# EAGLE design PSU (EAGLE 6.4)
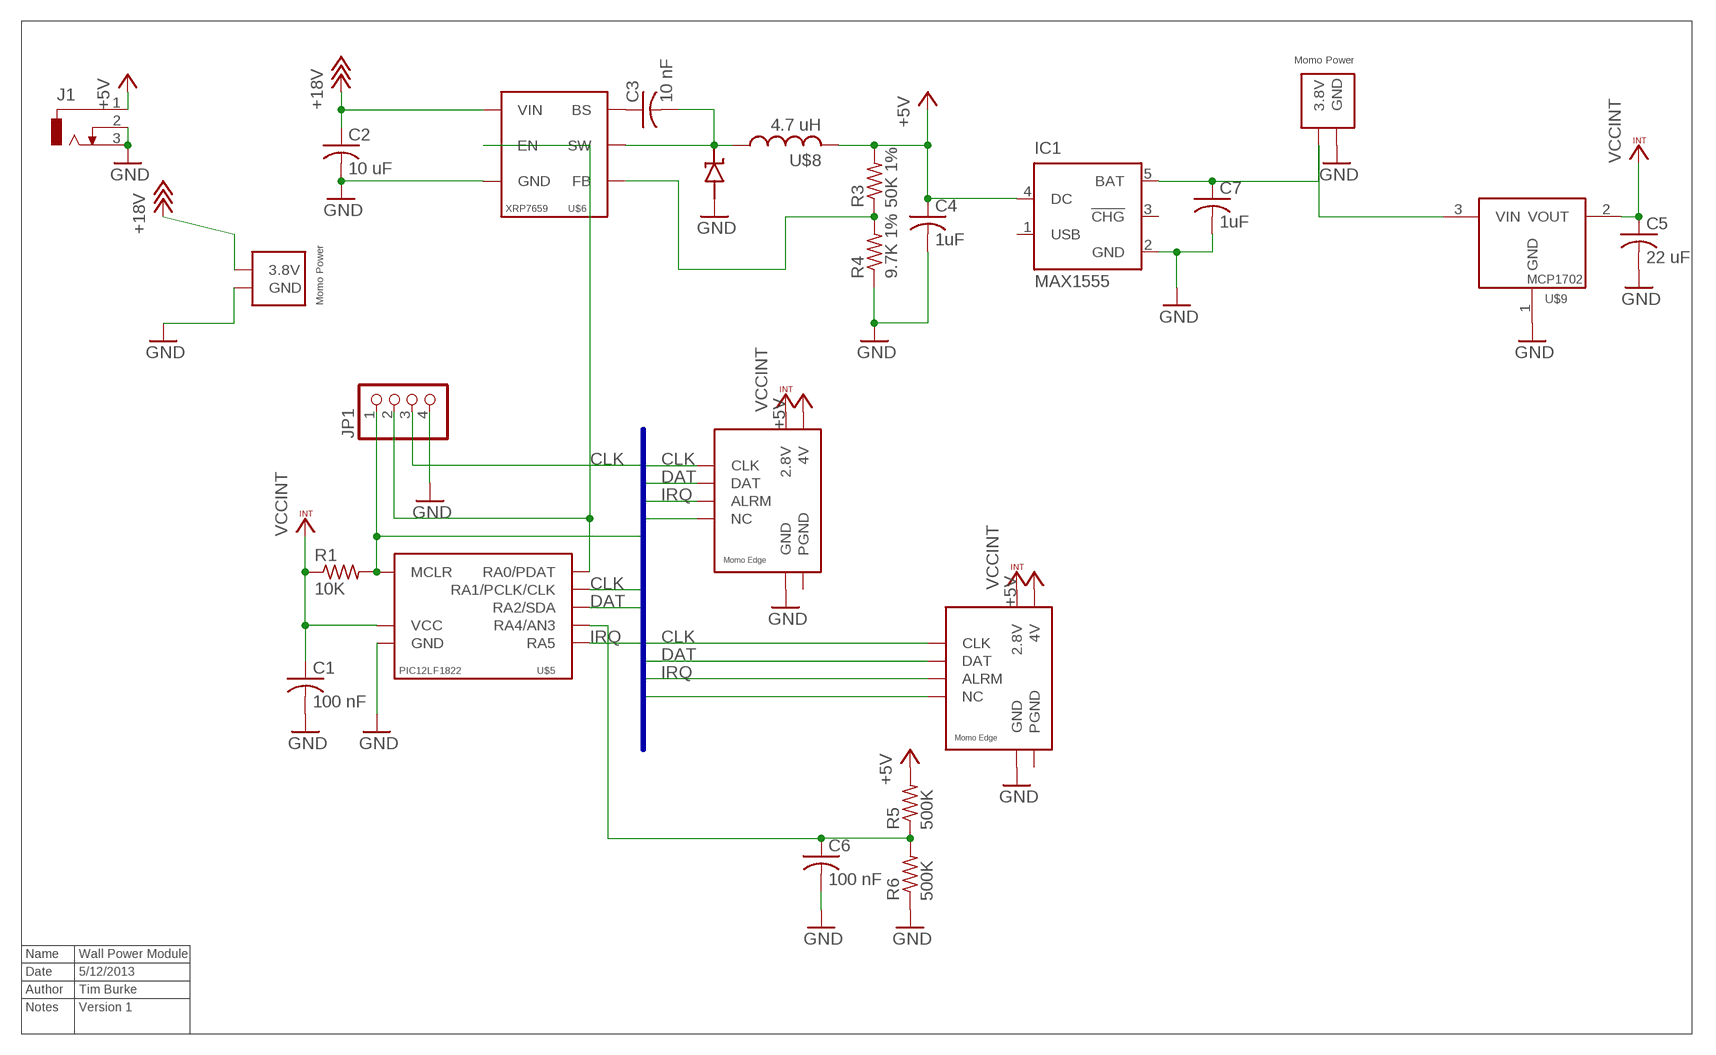
[diagram p0: schematic, sheet 1]

## Parts
C1  100 nF  C-USC0402  [C0402]
C2  10 uF  C-USC0805  [C0805]
C3  10 nF  C-USC0402  [C0402]
C4  1uF  C-USC0402  [C0402]
C5  22 uF  C-USC0402  [C0402]
C6  100 nF  C-USC0402  [C0402]
C7  1uF  C-USC0402  [C0402]
IC1  MAX1555  [SOT23-5L]
J1  DCJ0303  [DCJ0303]
JP1  PINHD-1X4  [1X04]
R1  10K  R-US_R0603  [R0603]
R3  50K 1%  R-US_R0603  [R0603]
R4  9.7K 1%  R-US_R0603  [R0603]
R5  500K  R-US_R0603  [R0603]
R6  500K  R-US_R0603  [R0603]
U$1  MOMO-EDGE-POWER-M  [MOMO-EDGE-SMALL-2M]
U$2  MOMO-EDGE-POWER-M  [MOMO-EDGE-SMALL-2M]
U$5  PIC12LF1822  [SOIC8]
U$6  XRP7659  [SOT23-6L]
U$7  DIODE_SS2P3  [DIODE_SS2P3]
U$8  4.7 uH  NR6028-INDUCTOR  [NR6028-INDUCTOR]
U$9  MCP1702  [SOT23]
U$10  MOMO-EDGE-8F  [MOMO-EDGE-8F]
U$11  MOMO-EDGE-8M  [MOMO-EDGE-8M]

## Nets
+5V: C4.1 IC1.4(DC) J1.1 R3.2 R5.2 U$8.2 U$10.V4.(4V) U$11.V4(4V)
+18V: C2.1 U$1.1(3.8V) U$6.5(VIN)
CLK: JP1.3 U$5.6(RA1/PCLK/CLK) U$10.CLK U$11.CLK
DAT: U$5.5(RA2/SDA) U$10.DAT U$11.DAT
GND: C1.2 C2.2 C4.2 C5.2 C6.2 C7.2 IC1.2(GND) J1.2 J1.3 JP1.4 R4.1 R6.1 U$1.2(GND) U$2.2(GND) U$5.8(GND) U$6.2(GND) U$7.AN U$9.1(GND) U$10.GND U$11.GND
IRQ: U$5.2(RA5) U$10.ARLM(ALRM) U$11.ALRM
MCLR: JP1.1 R1.2 U$5.4(MCLR) U$10.NV(NC) U$11.NC
N$1: C7.1 IC1.5(BAT) U$2.1(3.8V) U$9.3(VIN)
N$2: C3.2 U$6.6(SW) U$7.CATH U$8.1
N$4: C3.1 U$6.1(BS)
N$5: C6.1 R5.1 R6.2 U$5.3(RA4/AN3)
N$6: R3.1 R4.2 U$6.3(FB)
N$8: JP1.2 U$5.7(RA0/PDAT) U$6.4(EN)
VCCINT: C1.1 C5.1 R1.1 U$5.1(VCC) U$9.2(VOUT) U$10.V28(2.8V) U$11.V28(2.8V)
Unconnected: IC1.1(USB) IC1.3(!CHG)

## Buses
PICBUS:CLK,DAT,IRQ,MCLR

## Notes on the sheet
- Name | Wall Power Module
- Date | 5/12/2013
- Author | Tim Burke
- Notes | Version 1

## Power pins joined to a net without a drawn wire
PGND: U$10.PGND U$11.PGND

## Library data of the parts
C1-C7 = rcl:C-US: CAPACITOR, American symbol
IC1 = maxim:MAX1555: Dual-Input USB/AC Adapter 1-Cell Li+ Battery Chargers Source: http://www.maxim-ic.com .. MAX1551-MAX1555.pdf; MF: MAXIM; MPN: MAX1555EZK+T; OC_FARNELL: 1628222; OC_NEWARK: 59J2761
J1 = con-jack:DCJ0303: DC POWER JACK Source: DCJ0303.pdf; OC_FARNELL: unknown; OC_NEWARK: unknown
JP1 = pinhead:PINHD-1X4: PIN HEADER
R1 R3-R6 = rcl:R-US_: RESISTOR, American symbol
U$1 U$2 = components:MOMO-EDGE-POWER-M
U$5 = components:PIC12LF1822
U$6 = components:XRP7659
U$7 = components:DIODE_SS2P3
U$8 = components:NR6028-INDUCTOR
U$9 = components:MCP1702
U$10 = components:MOMO-EDGE-8F
U$11 = components:MOMO-EDGE-8M

## Board
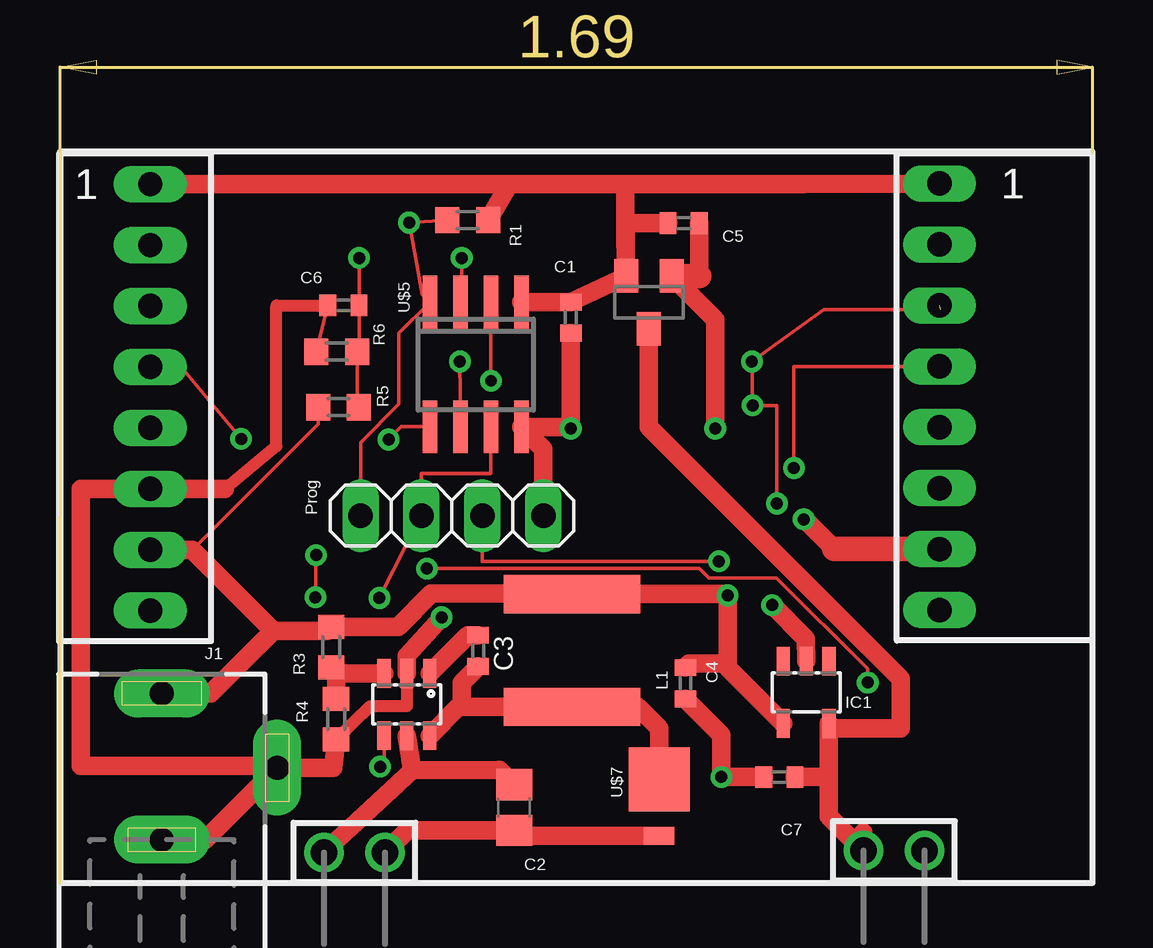
[diagram p1: board, top side]
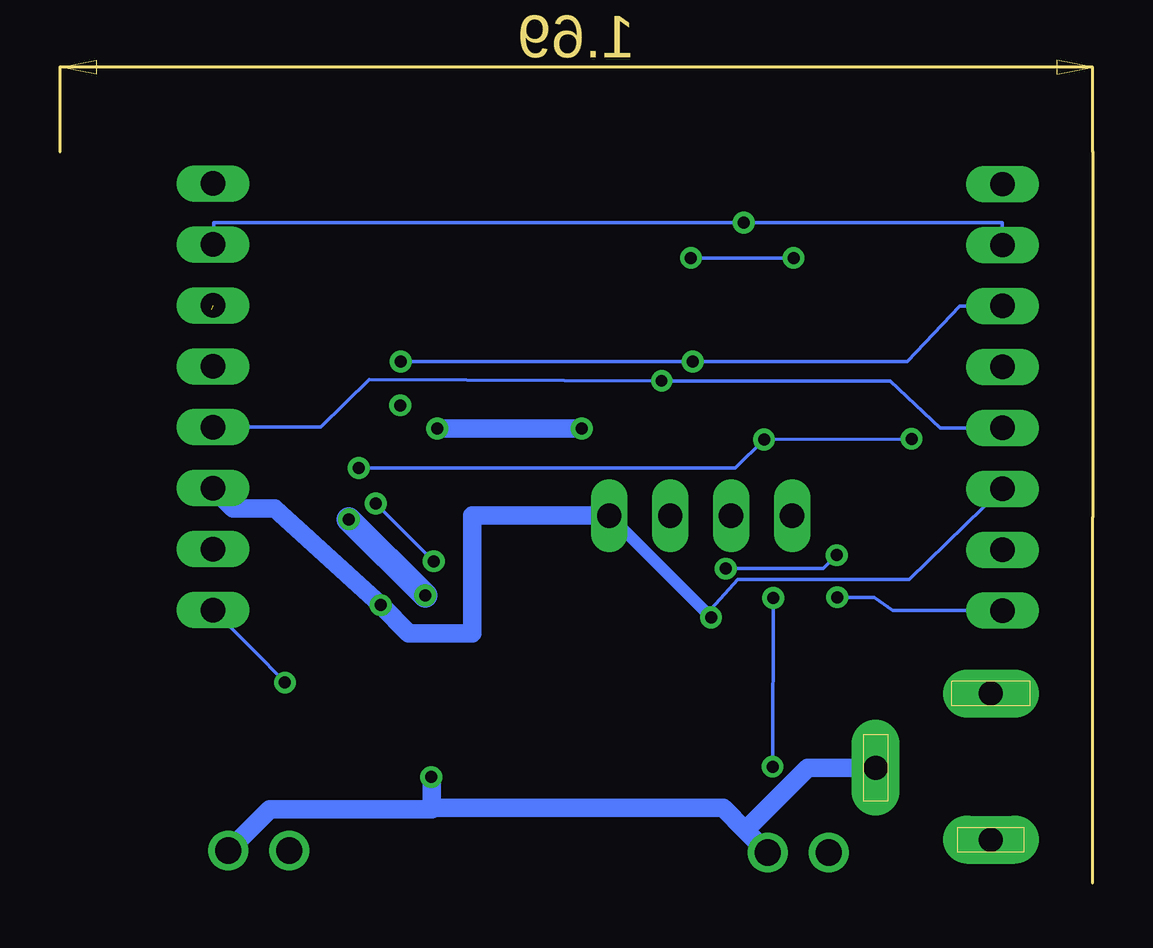
[diagram p2: board, bottom side, seen from below]

Size 43.03 x 34.31 mm. Coordinates in mm from the lower left corner, seen from the top.
Copper layers (1*16): Top 0.035mm / dielectric 1.5mm / Bottom 0.035mm
Design rules "default *": minimum track width 6mil, minimum drill 19mil, track to track 6mil, track to pad 6mil, pad to pad 6mil, via to via 6mil, smd to smd 6mil, copper to edge 40mil, drill to drill 8mil, minimum pad ring 10mil, minimum via ring 8mil, stop-mask expansion 4mil, vias tented up to drill 0mil, thermal gap 10mil

### Footprints (pad centres in the part's own frame; a part is rotated, then mirrored left to right if it is on the bottom)
C0402 = smd 0.7 x 0.9: 1 -0.65,0; 2 0.65,0
C0805 = smd 1.3 x 1.5: 1 -0.95,0; 2 0.95,0
SOT23-5L = smd 0.55 x 1.2: 1 -0.95,-1.3; 2 0,-1.3; 3 0.95,-1.3; 4 0.95,1.3; 5 -0.95,1.3
DCJ0303 = drill 1 pad 2 long: 1 0,3.1; 2 4.8,0; 3 0,-3
1X04 = drill 1.016 long: 1 -3.81,0; 2 -1.27,0; 3 1.27,0; 4 3.81,0
R0603 = smd 1 x 1.1: 1 -0.85,0; 2 0.85,0
MOMO-EDGE-SMALL-2M = drill 1.1: 1 1.27,0; 2 -1.27,0
SOIC8 = smd 0.6 x 2.2: 1 -1.905,-2.6; 2 -0.635,-2.6; 3 0.635,-2.6; 4 1.905,-2.6; 5 1.905,2.6; 6 0.635,2.6; 7 -0.635,2.6; 8 -1.905,2.6
SOT23-6L = smd 0.55 x 1.2: 1 -0.95,-1.3; 2 0,-1.3; 3 0.95,-1.3; 4 0.95,1.3; 5 0,1.3; 6 -0.95,1.3
DIODE_SS2P3 = smd 0.762 x 1.27: AN 2.349,0 | smd 2.667 x 2.54: CATH 0,0
NR6028-INDUCTOR = smd 1.6 x 5.7: 1 0,0; 2 4.7,0
SOT23 = smd 1 x 1.4: 1 -0.95,-1.1; 2 0.95,-1.1; 3 0,1.1
MOMO-EDGE-8F = drill 1.016 long: ARLM 0,0; CLK 0,5.08; DAT 0,2.54; GND 0,-2.54; NV 0,7.62; PGND 0,-7.62; V4. 0,-5.08; V28 0,10.16
MOMO-EDGE-8M = drill 1.016 long: ALRM 0,0; CLK 0,5.08; DAT 0,2.54; GND 0,-2.54; NC 0,7.62; PGND 0,-7.62; V4 0,-5.08; V28 0,10.16

### Placement (x,y rotation side)
C1  21.29,23.57 270 top
C2  18.92,3.15 270 top
C3  17.42,9.68 270 top
C4  26.06,8.33 270 top
C5  25.98,27.51 0 top
C6  11.81,24.08 180 top
C7  29.97,4.42 180 top
IC1  31.09,7.95 180 top
J1  4.24,4.8 0 top
JP1  16.33,15.32 0 top
R1  16.99,27.64 180 top
R3  11.3,9.83 90 top
R4  11.51,6.83 90 top
R5  11.61,19.84 180 top
R6  11.53,22.15 0 top
U$1  12.27,1.27 180 top
U$2  34.75,1.35 180 top
U$5  17.32,21.62 180 top
U$6  14.45,7.44 180 top
U$7  24.97,4.32 270 top
U$8  21.34,7.34 90 top
U$9  24.54,24.21 180 top
U$10  36.65,19 0 top
U$11  3.76,18.97 0 top

### Tracks (layer width: path | path; a pad name or v marks a point on that pad's centre or on a via)
+5V  (via drill 0.5 pad 0.15)
  Top 0.152: 30.99,15.19 v30.99,15.16 | 5.51,13.89 10.76,19.14 R5.2
  Top 0.762: J1.1 6.27,7.9 8.89,10.52 | 8.89,10.52 11.14,10.52 R3.2 14.08,10.68 15.47,12.06 21.31,12.06 U$8.2 27.81,12.04 v27.81,11.99 27.81,9.14 | 32.26,13.92 30.99,15.19 | U$11.V4 5.51,13.89 8.89,10.52 | IC1.4 27.81,8.98 27.81,9.14 | C4.1 26.22,9.14 27.81,9.14
  Top 1.016: U$10.V4. 32.26,13.92
  Bottom 1.016: v30.99,15.16 v27.81,11.99
+18V
  Top 0.762: U$1.1 14.68,4.7 | 14.68,4.7 U$6.5 | C2.1 18.3,4.72 14.68,4.7
CLK  (via drill 0.5 pad 0.15)  (1 unrouted)
  Top 0.152: 36.7,23.9 31.83,23.9 v28.83,21.74 v28.85,19.91 29.87,19.91 | v16.66,21.74 U$5.6 | JP1.3 17.6,13.41 v27.46,13.41 | v29.87,15.82 29.87,19.91 | 29.84,19.89 29.87,19.91
  Bottom 0.152: U$11.CLK 5.54,24.05 7.72,21.74 v16.66,21.74 v28.83,21.74 | v27.46,13.41 v29.87,15.82
DAT  (via drill 0.5 pad 0.15)
  Top 0.152: v7.54,18.52 5.05,21.51 U$11.DAT | v13.69,18.49 14.22,19.02 15.41,19.02 U$5.5 | U$10.DAT 30.58,21.54 v30.58,17.3
  Bottom 0.152: v7.54,18.52 v13.69,18.49 14.88,17.3 v30.58,17.3
GND  (via drill 0.5, 0.5 pad 0.15)
  Top 0.152: 25.11,2.11 U$7.AN | 19.15,1.97 C2.2 | R6.1 C6.2 | v21.29,18.95 21.29,19.02 | 9.04,4.88 9.04,4.72
  Top 0.508: 6.86,16.43 9.02,18.21 9.02,24.08 C6.2 | U$6.2 14.45,7.37 12.93,7.37 R4.1
  Top 0.762: J1.3 6.04,1.8 J1.2 11.39,4.8 R4.1 | 26.63,25.31 C5.2 | IC1.2 31.06,10.19 v29.67,11.58 | U$7.AN 19.15,1.97 | C2.2 14.47,2.2 U$1.2 | C1.2 21.29,19.02 U$5.8 20.14,18.1 JP1.4 | U$6.2 14.45,9.47 v15.9,11.07 | U$9.1 27.3,23.49 v27.3,18.95 | 9.04,4.88 0.86,4.88 0.86,16.43 U$11.GND 6.86,16.43 | C7.2 v27.56,4.42 27.56,6.18 C4.2
  Top 1.016: U$9.1 26.63,25.31
  Bottom 0.152: U$11.GND 7.65,12.65 14.78,12.65 15.9,11.43 v15.9,11.07
  Bottom 0.508: JP1.4 v15.9,11.07
  Bottom 0.762: U$10.GND 35.81,15.62 34.09,15.62 v29.67,11.58 28.5,10.41 25.86,10.41 25.86,15.32 JP1.4 | 14.47,2.2 15.39,3.12 27.48,3.12 27.53,3.07 | 14.47,2.2 U$1.2 | v27.3,18.95 v21.29,18.95 | 14.47,2.2 11.87,4.8 J1.2 | U$2.2 34.29,3.07 27.53,3.07 | 27.53,3.07 27.53,4.39 v27.56,4.42
IRQ  (via drill 0.48 pad 0.15)
  Top 0.152: U$5.2 v17.96,20.93
  Bottom 0.152: U$10.ARLM 32.16,19 30.15,20.98 v17.96,20.93 8.43,20.93 6.35,18.97 U$11.ALRM
MCLR  (via drill 0.5 pad 0.15)
  Top 0.152: R1.2 v14.54,27.53 15.1,24.53 U$5.4 14.12,22.92 14.12,19.96 12.52,18.36 JP1.1
  Bottom 0.152: U$10.NV 36.63,26.59 36.63,27.53 v14.54,27.53 3.76,27.53 U$11.NC
N$1
  Top 0.762: U$2.1 33.45,1.35 | 33.48,2.11 U$2.1 | U$9.3 24.54,19 35.03,8.51 35.03,6.45 32.04,6.45 IC1.5 32.04,5.94 32.04,4.42 | 32.04,4.42 32.04,2.78 U$2.1 | C7.1 32.04,4.42
N$2
  Top 0.762: U$7.CATH 24.97,6.45 24.08,7.34 U$8.1 16.74,7.34 | U$6.6 16.6,7.34 16.74,7.34 | C3.2 16.74,8.34 16.74,7.34
N$4
  Top 0.762: U$6.1 16.99,10.33 C3.1
N$5  (via drill 0.5 pad 0.15)
  Top 0.152: R5.1 12.38,19.91 R6.2 12.46,22.23 C6.1 v12.46,26.06 | U$5.3 16.74,24.22 v16.74,26.06
  Bottom 0.152: v16.74,26.06 v12.46,26.06
N$6
  Top 0.762: U$6.3 11.54,8.74 R3.1 11.51,8.78 R4.2
N$8  (via drill 0.5 pad 0.15)
  Top 0.152: U$6.4 13.5,4.85 v13.33,4.85 | v13.31,11.89 JP1.2 15.06,17.07 17.96,17.07 U$5.7
  Bottom 0.152: v13.33,4.85 v13.31,11.89
PGND  (via drill 0.5 pad 0.15)
  Top 0.152: v15.29,13.11 26.64,13.11 27.03,12.73 29.84,12.73 33.65,8.92 v33.65,8.36 | v10.64,11.91 v10.67,13.66
  Bottom 0.152: v33.65,8.36 34.54,9.27 U$10.PGND | U$11.PGND 8.33,11.35 9.09,11.91 v10.64,11.91 | v15.29,13.11 11.23,13.11 v10.67,13.66
VCCINT
  Top 0.762: U$11.V28 18.72,29.13 | 18.72,29.13 23.55,29.13 | 23.55,29.13 30.99,29.13 U$10.V28 | 23.57,25.83 U$9.2 C1.1 U$5.1 | 23.57,25.83 23.55,27.06 23.55,29.13 | R1.1 18.72,29.13 | C5.1 23.57,27.51 23.57,25.83

### Text on the board
tPlace: Prog | L1